# EAGLE design ciao_1_1 (EAGLE 8.5.2)
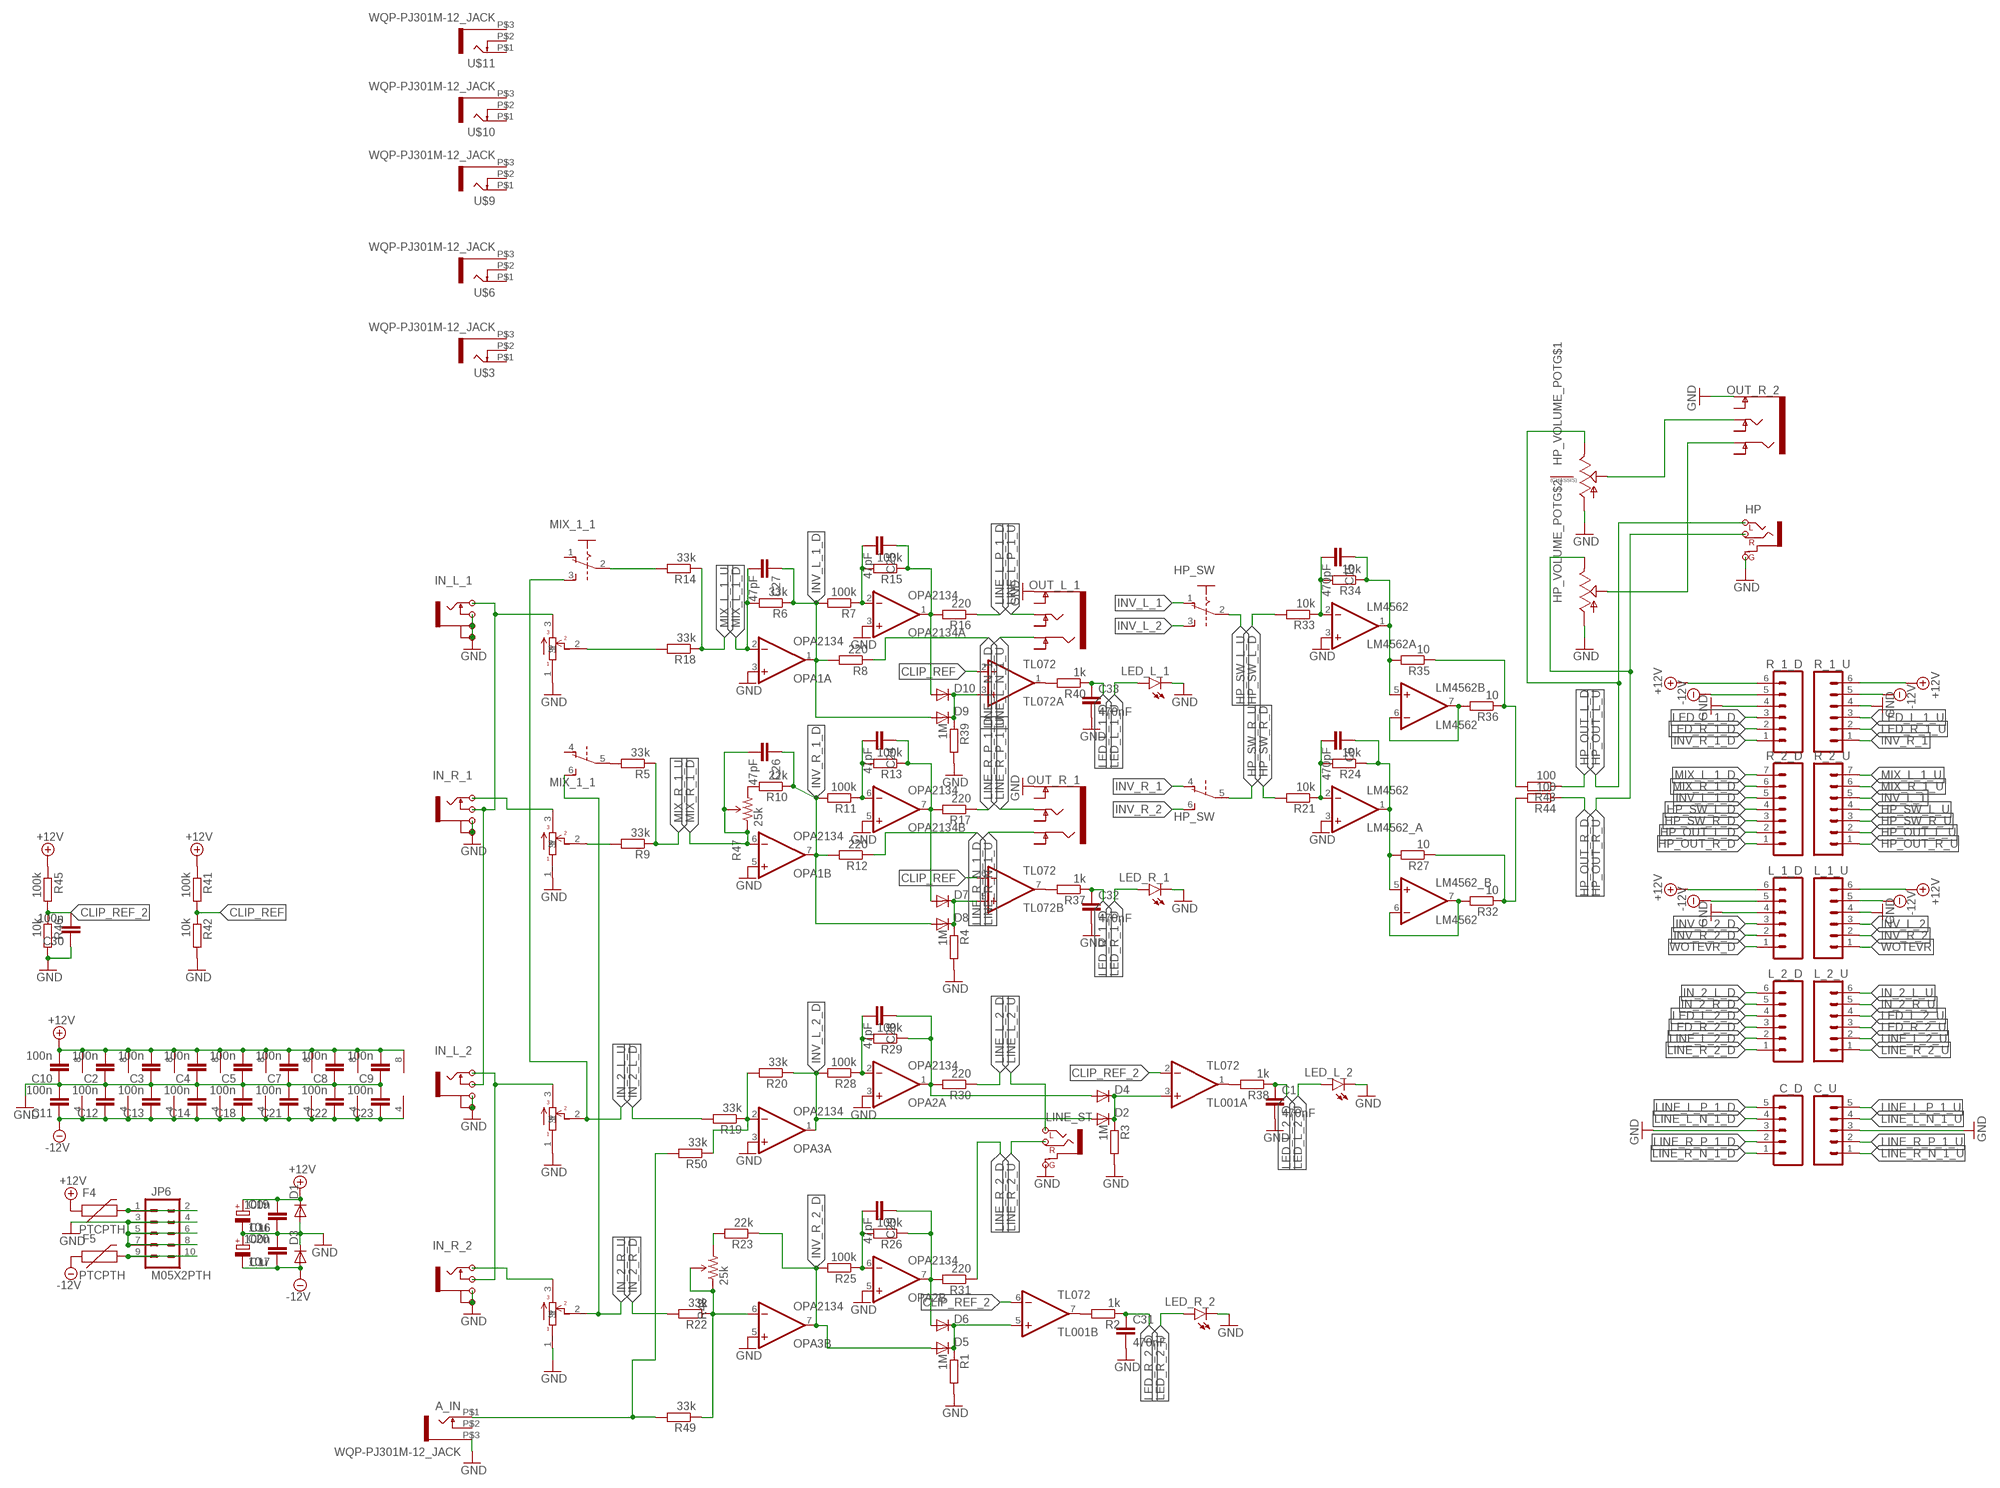
[diagram p0: schematic, sheet 1]

## Parts
A_IN  WQP-PJ301M-12_JACK  [WQP-PJ301M-12_JACK]
C1  470nF  C-EU050-024X044  [C050-024X044]
C2  100n  C-EU050-024X044  [C050-024X044]
C3  100n  C-EU050-024X044  [C050-024X044]
C4  100n  C-EU050-024X044  [C050-024X044]
C5  100n  C-EU050-024X044  [C050-024X044]
C6  470pF  C-EU050-024X044  [C050-024X044]
C7  100n  C-EU050-024X044  [C050-024X044]
C8  100n  C-EU050-024X044  [C050-024X044]
C9  100n  C-EU050-024X044  [C050-024X044]
C10  100n  C-EU050-024X044  [C050-024X044]
C11  100n  C-EU050-024X044  [C050-024X044]
C12  100n  C-EU050-024X044  [C050-024X044]
C13  100n  C-EU050-024X044  [C050-024X044]
C14  100n  C-EU050-024X044  [C050-024X044]
C15  470pF  C-EU050-024X044  [C050-024X044]
C16  100n  C-EU050-024X044  [C050-024X044]
C17  100n  C-EU050-024X044  [C050-024X044]
C18  100n  C-EU050-024X044  [C050-024X044]
C19  10u  CPOL-EUE2-5  [E2-5]
C20  10u  CPOL-EUE2-5  [E2-5]
C21  100n  C-EU050-024X044  [C050-024X044]
C22  100n  C-EU050-024X044  [C050-024X044]
C23  100n  C-EU050-024X044  [C050-024X044]
C24  47pF  C-EU050-024X044  [C050-024X044]
C25  47pF  C-EU050-024X044  [C050-024X044]
C26  47pF  C-EU050-024X044  [C050-024X044]
C27  47pF  C-EU050-024X044  [C050-024X044]
C28  47pF  C-EU050-024X044  [C050-024X044]
C29  47pF  C-EU050-024X044  [C050-024X044]
C30  100n  C-EU050-024X044  [C050-024X044]
C31  470nF  C-EU050-024X044  [C050-024X044]
C32  470nF  C-EU050-024X044  [C050-024X044]
C33  470nF  C-EU050-024X044  [C050-024X044]
C_D  M05PTH  [1X05]
C_U  M05PTH  [1X05]
CH_1_POT  POTAK_DUAL  [POTAK_DUAL]
CH_2_POT  POTAK_DUAL  [POTAK_DUAL]
D1  DIODE-D-7.5  [D-7.5]
D2  DIODE-D-5  [D-5]
D3  DIODE-D-7.5  [D-7.5]
D4  DIODE-D-5  [D-5]
D5  DIODE-D-5  [D-5]
D6  DIODE-D-5  [D-5]
D7  DIODE-D-5  [D-5]
D8  DIODE-D-5  [D-5]
D9  DIODE-D-5  [D-5]
D10  DIODE-D-5  [D-5]
F4  PTCPTH  [PTC]
F5  PTCPTH  [PTC]
HP  STEREO  [STEREO]
HP_SW  A68-A31  [A68-A31]
HP_VOLUME_POT  ALPHA-9MM-DUALPOT  [DUAL_9MM_SNAP-IN_POT]
IN_L_1  PJ-301BMB  [PJ-301BM-B]
IN_L_2  PJ-301BMB  [PJ-301BM-B]
IN_R_1  PJ-301BMB  [PJ-301BM-B]
IN_R_2  PJ-301BMB  [PJ-301BM-B]
JP6  M05X2PTH  [AVR_ICSP]
L_1_D  M06NO_SILK  [1X06_NO_SILK]
L_1_U  M06NO_SILK  [1X06_NO_SILK]
L_2_D  M06NO_SILK  [1X06_NO_SILK]
L_2_U  M06NO_SILK  [1X06_NO_SILK]
LED_L_1  LED3MM  [LED3MM]
LED_L_2  LED3MM  [LED3MM]
LED_R_1  LED3MM  [LED3MM]
LED_R_2  LED3MM  [LED3MM]
LINE_ST  STEREO  [STEREO]
LM4562  LM4562  TL072P  [DIL08]
LM4562_  LM4562  TL072P  [DIL08]
MIX_1_1  A68-A31  [A68-A31]
OPA1  OPA2134  TL072P  [DIL08]
OPA2  OPA2134  TL072P  [DIL08]
OPA3  OPA2134  TL072P  [DIL08]
OPA2134  OPA2134  TL072P  [DIL08]
OUT_L_1  AUDIO-JACK4-.25-HORIZ-TRS  [AUDIO-JACK-.25-INCH-HORIZ-PTH]
OUT_R_1  AUDIO-JACK4-.25-HORIZ-TRS  [AUDIO-JACK-.25-INCH-HORIZ-PTH]
OUT_R_2  AUDIO-JACK4-.25-HORIZ-TRS  [AUDIO-JACK-.25-INCH-HORIZ-PTH]
R1  1M  R-EU_0204/5  [0204/5]
R2  1k  R-EU_0204/5  [0204/5]
R3  1M  R-EU_0204/5  [0204/5]
R4  1M  R-EU_0204/5  [0204/5]
R5  33k  R-EU_0204/5  [0204/5]
R6  33k  R-EU_0204/5  [0204/5]
R7  100k  R-EU_0204/5  [0204/5]
R8  220  R-EU_0204/5  [0204/5]
R9  33k  R-EU_0204/5  [0204/5]
R10  22k  R-EU_0204/5  [0204/5]
R11  100k  R-EU_0204/5  [0204/5]
R12  220  R-EU_0204/5  [0204/5]
R13  100k  R-EU_0204/5  [0204/5]
R14  33k  R-EU_0204/5  [0204/5]
R15  100k  R-EU_0204/5  [0204/5]
R16  220  R-EU_0204/5  [0204/5]
R17  220  R-EU_0204/5  [0204/5]
R18  33k  R-EU_0204/5  [0204/5]
R19  33k  R-EU_0204/5  [0204/5]
R20  33k  R-EU_0204/5  [0204/5]
R21  10k  R-EU_0204/5  [0204/5]
R22  33k  R-EU_0204/5  [0204/5]
R23  22k  R-EU_0204/5  [0204/5]
R24  10k  R-EU_0204/5  [0204/5]
R25  100k  R-EU_0204/5  [0204/5]
R26  100k  R-EU_0204/5  [0204/5]
R27  10  R-EU_0204/5  [0204/5]
R28  100k  R-EU_0204/5  [0204/5]
R29  100k  R-EU_0204/5  [0204/5]
R30  220  R-EU_0204/5  [0204/5]
R31  220  R-EU_0204/5  [0204/5]
R32  10  R-EU_0204/5  [0204/5]
R33  10k  R-EU_0204/5  [0204/5]
R34  10k  R-EU_0204/5  [0204/5]
R35  10  R-EU_0204/5  [0204/5]
R36  10  R-EU_0204/5  [0204/5]
R37  1k  R-EU_0204/5  [0204/5]
R38  1k  R-EU_0204/5  [0204/5]
R39  1M  R-EU_0204/5  [0204/5]
R40  1k  R-EU_0204/5  [0204/5]
R41  100k  R-EU_0204/5  [0204/5]
R42  10k  R-EU_0204/5  [0204/5]
R43  100  R-EU_0204/5  [0204/5]
R44  100  R-EU_0204/5  [0204/5]
R45  100k  R-EU_0204/5  [0204/5]
R46  10k  R-EU_0204/5  [0204/5]
R47  25k  TRIMPOTTRIM_POT_PTH_STAND  [TRIM_POT_PTH_STAND]
R48  25k  TRIMPOTTRIM_POT_PTH_STAND  [TRIM_POT_PTH_STAND]
R49  33k  R-EU_0204/5  [0204/5]
R50  33k  R-EU_0204/5  [0204/5]
R_1_D  M06NO_SILK  [1X06_NO_SILK]
R_1_U  M06NO_SILK  [1X06_NO_SILK]
R_2_D  M07  [1X07]
R_2_U  M07  [1X07]
TL001  TL072  TL072P  [DIL08]
TL072  TL072  TL072P  [DIL08]
U$3  WQP-PJ301M-12_JACK  [WQP-PJ301M-12_JACK]
U$6  WQP-PJ301M-12_JACK  [WQP-PJ301M-12_JACK]
U$9  WQP-PJ301M-12_JACK  [WQP-PJ301M-12_JACK]
U$10  WQP-PJ301M-12_JACK  [WQP-PJ301M-12_JACK]
U$11  WQP-PJ301M-12_JACK  [WQP-PJ301M-12_JACK]

## Nets
+12V: C2.2 C3.2 C4.2 C5.2 C7.2 C8.2 C9.2 C10.2 C16.2 C19.+ D1.C F4.P$1 L_1_D.6 L_1_U.6 LM4562.8(P:V+) LM4562_.8(P:V+) OPA1.8(P:V+) OPA2.8(P:V+) OPA3.8(P:V+) OPA2134.8(P:V+) R41.1 R45.1 R_1_D.6 R_1_U.6 TL001.8(P:V+) TL072.8(P:V+)
-12V: C11.1 C12.1 C13.1 C14.1 C17.1 C18.1 C20.- C21.1 C22.1 C23.1 D3.A F5.P$1 L_1_D.5 L_1_U.5 LM4562.4(P:V-) LM4562_.4(P:V-) OPA1.4(P:V-) OPA2.4(P:V-) OPA3.4(P:V-) OPA2134.4(P:V-) R_1_D.5 R_1_U.5 TL001.4(P:V-) TL072.4(P:V-)
CLIP_REF: R41.2 R42.1 TL072.2(A:-IN) TL072.6(B:-IN)
CLIP_REF_2: C30.2 R45.2 R46.1 TL001.2(A:-IN) TL001.6(B:-IN)
CLIP_REF_ADFPOASH: D5.C D6.C R1.1 TL001.5(B:+IN)
GND: A_IN.P$3 C1.2 C2.1 C3.1 C4.1 C5.1 C7.1 C8.1 C9.1 C10.1 C11.2 C12.2 C13.2 C14.2 C16.1 C17.2 C18.2 C19.- C20.+ C21.2 C22.2 C23.2 C30.1 C31.2 C32.2 C33.2 C_D.3 C_U.3 CH_1_POT.1 CH_1_POT.1_ CH_2_POT.1 CH_2_POT.1_ D1.A D3.C HP.GND(G) HP_VOLUME_POT.1(A) HP_VOLUME_POT.1B(A) IN_L_1.G1 IN_L_1.G2 IN_L_1.SW IN_L_2.G1 IN_L_2.G2 IN_R_1.G1 IN_R_1.G2 IN_R_2.G1 IN_R_2.G2 JP6.3 JP6.4 JP6.5 JP6.6 JP6.7 JP6.8 L_1_D.4 L_1_U.4 LED_L_1.K(C) LED_L_2.K(C) LED_R_1.K(C) LED_R_2.K(C) LINE_ST.GND(G) LM4562.3(A:+IN) LM4562_.3(A:+IN) OPA1.3(A:+IN) OPA1.5(B:+IN) OPA2.3(A:+IN) OPA2.5(B:+IN) OPA3.3(A:+IN) OPA3.5(B:+IN) OPA2134.3(A:+IN) OPA2134.5(B:+IN) OUT_L_1.P$2(EARTH) OUT_R_1.P$2(EARTH) OUT_R_2.P$2(EARTH) R1.2 R3.2 R4.2 R39.2 R42.2 R46.2 R_1_D.4 R_1_U.4
HP_OUT_L_D: R43.1 R_2_D.2
HP_OUT_L_U: HP.LEFT_(L) HP_VOLUME_POT.3(E) R_2_U.2
HP_OUT_R_D: R44.1 R_2_D.1
HP_OUT_R_U: HP.RIGHT_(R) HP_VOLUME_POT.3B(E) R_2_U.1
HP_SW_L_D: R33.2 R_2_D.4
HP_SW_L_U: HP_SW.2(A:P) R_2_U.4
HP_SW_R_D: R21.2 R_2_D.3
HP_SW_R_U: HP_SW.5(B:P) R_2_U.3
IN_2_L_D: L_2_D.6 R19.2
IN_2_L_U: CH_2_POT.2 L_2_U.6 MIX_1_1.3(A:S)
IN_2_R_D: L_2_D.5 R22.2
IN_2_R_U: CH_2_POT.2_ L_2_U.5 MIX_1_1.6(B:S)
INV_L_1: HP_SW.1(A:O) R_2_U.5
INV_L_1_D: C27.1 D9.A OPA1.1(A:OUT) R6.1 R7.2 R8.2 R_2_D.5
INV_L_2: HP_SW.3(A:S) L_1_U.3
INV_L_2_D: D2.A L_1_D.3 OPA3.1(A:OUT) R20.1 R28.2
INV_R_1: HP_SW.4(B:O) R_1_U.1
INV_R_1_D: C26.1 D8.A OPA1.7(B:OUT) R10.1 R11.2 R12.2 R_1_D.1
INV_R_2: HP_SW.6(B:S) L_1_U.2
INV_R_2_D: D5.A L_1_D.2 OPA3.7(B:OUT) R23.1 R25.2
LED_L_1_D: C33.1 R40.1 R_1_D.3
LED_L_1_U: LED_L_1.A R_1_U.3
LED_L_2_D: C1.1 L_2_D.4 R38.1
LED_L_2_U: L_2_U.4 LED_L_2.A
LED_R_1_D: C32.1 R37.1 R_1_D.2
LED_R_1_U: LED_R_1.A R_1_U.2
LED_R_2_D: C31.1 L_2_D.3 R2.1
LED_R_2_U: L_2_U.3 LED_R_2.A
LINE_L_2_D: L_2_D.2 R30.1
LINE_L_2_U: L_2_U.2 LINE_ST.LEFT_(L)
LINE_L_N_1_D: C_D.4 R8.1
LINE_L_N_1_U: C_U.4 OUT_L_1.P$4(RING)
LINE_L_P_1_D: C_D.5 R16.1
LINE_L_P_1_U: C_U.5 OUT_L_1.P$6(TIP)
LINE_R_2_D: L_2_D.1 R31.1
LINE_R_2_U: L_2_U.1 LINE_ST.RIGHT_(R)
LINE_R_N_1_D: C_D.1 R12.1
LINE_R_N_1_U: C_U.1 OUT_R_1.P$4(RING)
LINE_R_P_1_D: C_D.2 R17.1
LINE_R_P_1_U: C_U.2 OUT_R_1.P$6(TIP)
MIX_L_1_D: C27.2 OPA1.2(A:-IN) R6.2 R_2_D.7
MIX_L_1_U: R14.1 R18.1 R_2_U.7
MIX_R_1_D: C26.2 OPA1.6(B:-IN) R47.1(CCW) R47.2(WIPER) R_2_D.6
MIX_R_1_U: R5.1 R9.1 R_2_U.6
N$1: R10.2 R47.3(CW)
N$2: CH_2_POT.3 IN_L_2.T IN_R_2.SW
N$3: R40.2 TL072.1(A:OUT)
N$4: CH_2_POT.3_ IN_R_2.T
N$5: C25.2 OPA2134.2(A:-IN) R7.1 R15.2
N$6: OPA3.6(B:-IN) R22.1 R48.1(CCW) R48.2(WIPER) R49.1
N$7: CH_1_POT.3_ IN_R_1.T
N$8: R23.2 R48.3(CW)
N$9: HP_VOLUME_POT.2(S)
N$10: C25.1 D10.A OPA2134.1(A:OUT) R15.1 R16.2
N$11: C24.2 OPA2134.6(B:-IN) R11.1 R13.2
N$12: A_IN.P$1 R49.2 R50.2
N$13: HP_VOLUME_POT.2B(S)
N$14: C24.1 D7.A OPA2134.7(B:OUT) R13.1 R17.2
N$15: CH_1_POT.2_ R9.2
N$16: CH_1_POT.2 R18.2
N$17: OPA3.2(A:-IN) R19.1 R20.2 R50.1
N$21: MIX_1_1.5(B:P) R5.2
N$22: MIX_1_1.2(A:P) R14.2
N$24: C29.2 OPA2.6(B:-IN) R25.1 R26.2
N$25: C29.1 D6.A OPA2.7(B:OUT) R26.1 R31.2
N$26: C6.2 LM4562_.2(A:-IN) R21.1 R24.2
N$27: C28.2 OPA2.2(A:-IN) R28.1 R29.2
N$28: C28.1 D4.A OPA2.1(A:OUT) R29.1 R30.2
N$30: C6.1 LM4562_.1(A:OUT) LM4562_.5(B:+IN) R24.1 R27.2
N$31: LM4562_.6(B:-IN) LM4562_.7(B:OUT) R32.2
N$32: R27.1 R32.1 R44.2
N$33: C15.2 LM4562.2(A:-IN) R33.1 R34.2
N$34: C15.1 LM4562.1(A:OUT) LM4562.5(B:+IN) R34.1 R35.2
N$35: LM4562.6(B:-IN) LM4562.7(B:OUT) R36.2
N$36: R37.2 TL072.7(B:OUT)
N$37: R35.1 R36.1 R43.2
N$42: D2.C D4.C R3.1 TL001.3(A:+IN)
N$43: CH_1_POT.3 IN_L_1.T IN_L_2.SW IN_R_1.SW
N$44: F4.P$2 JP6.1 JP6.2
N$45: F5.P$2 JP6.9 JP6.10
N$46: R38.2 TL001.1(A:OUT)
N$47: D7.C D8.C R4.1 TL072.5(B:+IN)
N$48: R2.2 TL001.7(B:OUT)
N$52: D9.C D10.C R39.1 TL072.3(A:+IN)
WOTEVR: L_1_U.1
WOTEVR_D: L_1_D.1
Unconnected: A_IN.P$2 HP_VOLUME_POT.CHASSIS1 HP_VOLUME_POT.CHASSIS2 MIX_1_1.1(A:O) MIX_1_1.4(B:O) OUT_L_1.P$3(EARTH-NORM) OUT_L_1.P$5(RING-NORM) OUT_L_1.P$7(TIP-NORM) OUT_R_1.P$3(EARTH-NORM) OUT_R_1.P$5(RING-NORM) OUT_R_1.P$7(TIP-NORM) OUT_R_2.P$3(EARTH-NORM) OUT_R_2.P$4(RING) OUT_R_2.P$5(RING-NORM) OUT_R_2.P$6(TIP) OUT_R_2.P$7(TIP-NORM) U$3.P$1 U$3.P$2 U$3.P$3 U$6.P$1 U$6.P$2 U$6.P$3 U$9.P$1 U$9.P$2 U$9.P$3 U$10.P$1 U$10.P$2 U$10.P$3 U$11.P$1 U$11.P$2 U$11.P$3

## Library data of the parts
A_IN U$3 U$6 U$9-U$11 = thonkiconn:WQP-PJ301M-12_JACK
C1-C18 C21-C33 = rcl:C-EU: CAPACITOR, European symbol
C19 C20 = rcl:CPOL-EU: POLARIZED CAPACITOR, European symbol
C_D C_U = SparkFun-Connectors:M05: Header 5 Standard 5-pin 0.1" header. Use with straight break away headers (SKU : PRT-00116), right angle break away headers (PRT-00553), swiss pins (PRT-00743), machine pins (PRT-00117), and female headers (PRT-00115). Molex polarized connector foot print use with SKU : PRT-08230 with associated crimp pins and housings.
CH_1_POT CH_2_POT = potak:POTAK_DUAL
D1-D10 = diode:DIODE-: DIODE
F4 F5 = SparkFun-PowerIC:PTC: Resettable Fuse PTC Resettable Fuse. Spark Fun Electronics SKU : COM-08357
HP LINE_ST = PJ-301BM:STEREO
HP_SW MIX_1_1 = switch:A68-A31: SLIDING SWITCH Siemens, distributor Buerklin, 11G766
HP_VOLUME_POT = MusicThingModular:ALPHA-9MM-DUALPOT: 9mm vertical snap-in pot, Alpha / Panasonic style, with a connection to the metal chassis for grounding
IN_L_1 IN_L_2 IN_R_1 IN_R_2 = PJ-301BM:PJ-301BM: PJ-301BM mfd. by Chuangjiebao 3.5mm Phone jack Mono, NC-switched. Vertical PCB mount, M6x0.5 threaded bushing. Jacks from 8/2009 Muffwiggler group buy.
JP6 = SparkFun-Connectors:M05X2: Header 5x2 Standard 10-pin dual row 0.1" header. Commonly used with AVR-ISP. Use with Spark Fun Electronics SKU: PRT-00778
L_1_D L_1_U L_2_D L_2_U R_1_D R_1_U = SparkFun-Connectors:M06: Header 6 Standard 6-pin 0.1" header. Use with straight break away headers (SKU : PRT-00116), right angle break away headers (PRT-00553), swiss pins (PRT-00743), machine pins (PRT-00117), and female headers (PRT-00115). Molex polarized connector foot print use with SKU : PRT-08094 with associated crimp pins and housings. NOTES ON THE VARIANTS LOCK and LOCK_LONGPADS... This footprint was designed to help hold the alignment of a through-hole component (i.e. 6-pin header) while soldering it into place. You may notice that each hole has been shifted either up or down by 0.005 of an inch from it's more standard position (which is a perfectly straight line). This slight alteration caused the pins (the squares in the middle) to touch the edges of the holes. Because they are alternating, it causes a "brace" to hold the component in place. 0.005 has proven to be the perfect amount of "off-center" position when using our standard breakaway headers. Although looks a little odd when you look at the bare footprint, once you have a header in there, the alteration is very hard to notice. Also,if you push a header all the way into place, it is covered up entirely on the bottom side. This idea of altering the position of holes to aid alignment will be further integrated into the Sparkfun Library for other footprints. It can help hold any component with 3 or more connection pins.
LED_L_1 LED_L_2 LED_R_1 LED_R_2 = SparkFun-LED:LED: LEDs Standard schematic elements and footprints for 5mm, 3mm, 1206, and 0603 sized LEDs. 5mm - Spark Fun Electronics SKU : COM-00529 (and others)
LM4562 LM4562_ OPA1-OPA3 OPA2134 TL001 TL072 = linear:TL072: OP AMP
OUT_L_1 OUT_R_1 OUT_R_2 = SparkFun-Connectors:AUDIO-JACK4-.25-HORIZ-TRS: 1/4" TRS jack, horizontal Production SKU: COM-11144 Footprint unproven - datasheet and part seem to be slightly different; PROD_ID: COM-11144
R1-R46 R49 R50 = rcl:R-EU_: RESISTOR, European symbol
R47 R48 = SparkFun-Electromechanical:TRIMPOT: Various small potentiometers for "set-and-forget" applications
R_2_D R_2_U = SparkFun-Connectors:M07: Header 7 Standard 7-pin 0.1" header. Use with straight break away headers (SKU : PRT-00116), right angle break away headers (PRT-00553), swiss pins (PRT-00743), machine pins (PRT-00117), and female headers (PRT-00115). NOTES ON THE VARIANTS LOCK and LOCK_LONGPADS... This footprint was designed to help hold the alignment of a through-hole component (i.e. 7-pin header) while soldering it into place. You may notice that each hole has been shifted either up or down by 0.005 of an inch from it's more standard position (which is usually a perfectly straight line). This slight alteration caused the pins (the squares in the middle) to touch the edges of the holes. Because they are alternating, it causes a "brace" to hold the header in place. 0.005 has proven to be the perfect amount of "off-center" position when using our standard breakaway headers. Although looks a little odd when you look at the bare footprint, once you have a header in there, the alteration is very hard to notice. Also, if you push a header all the way into place, it is covered up entirely on the bottom side. This idea of altering the position of holes to aid alignment will be further integrated into the Sparkfun Library for other footprints. It can help hold any component with 3 or more connection pins.

## Board
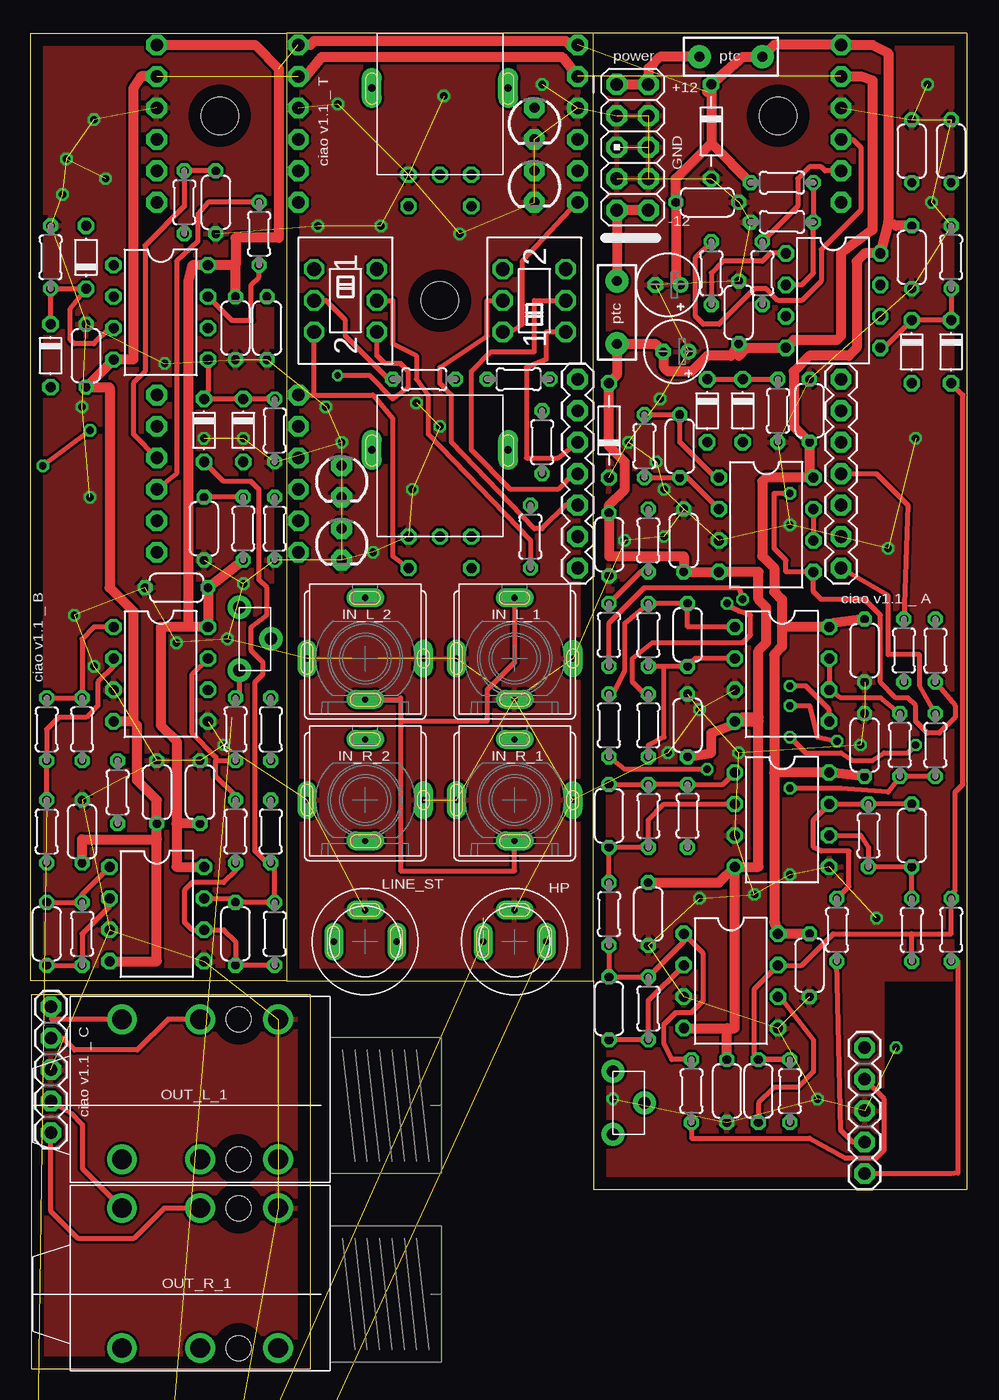
[diagram p1: board, top side]
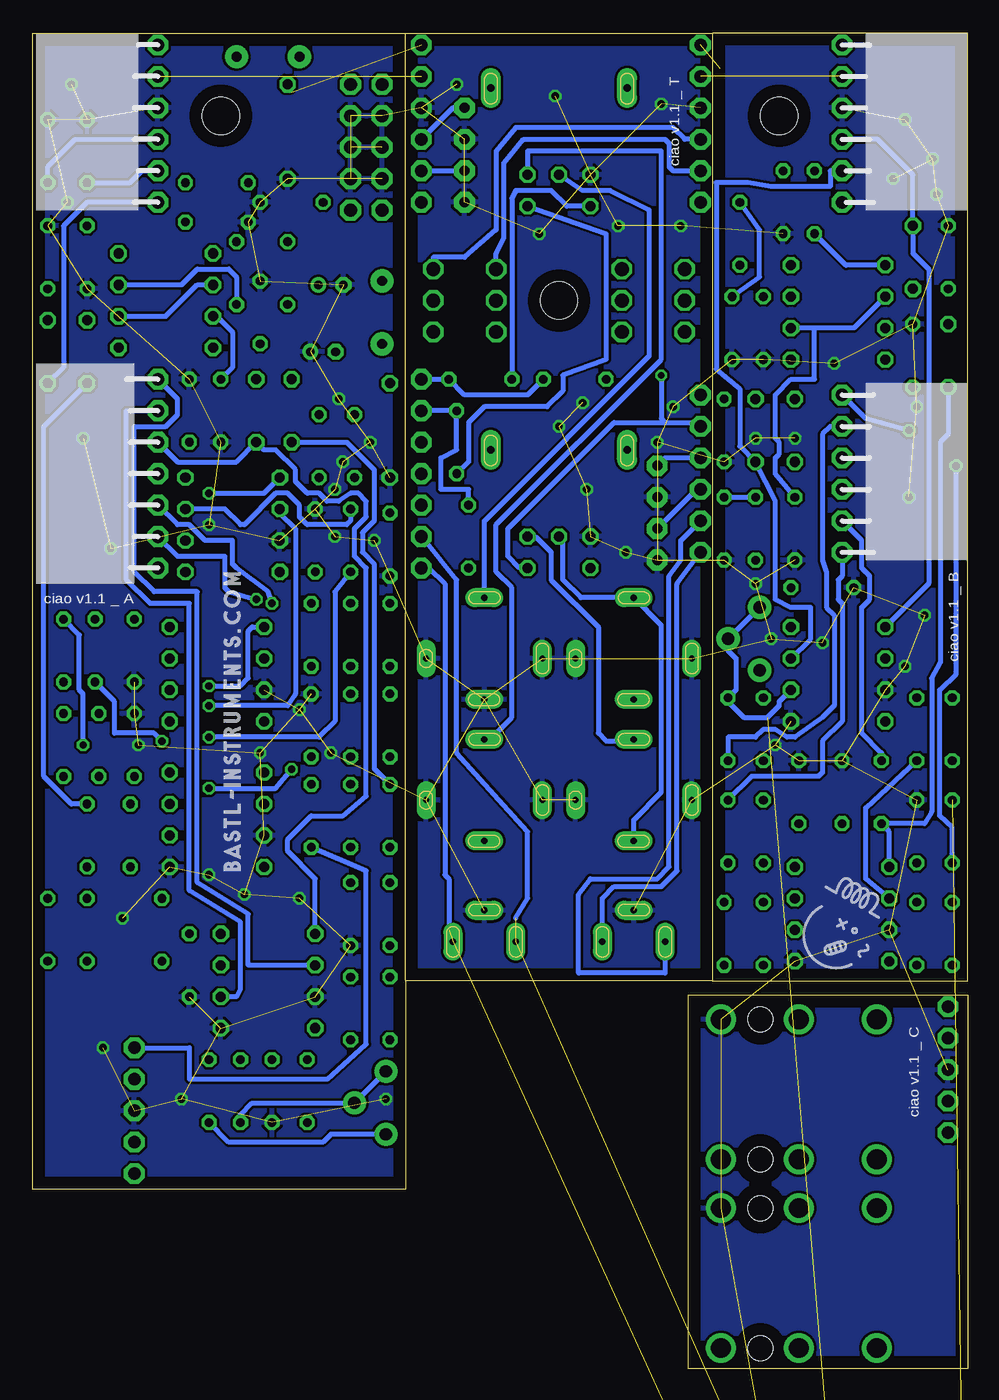
[diagram p2: board, bottom side, seen from below]

Size 75.56 x 107.81 mm. Coordinates in mm from the lower left corner, seen from the top.
Outline: 20.64,31.29 45.4,31.29
Outline: 45.4,31.29 45.4,107.81
Outline: 45.4,107.81 20.64,107.81
Outline: 20.64,107.81 20.64,31.29
Outline: 20.64,107.81 0,107.81 0,31.29 20.64,31.29
Outline: 45.4,31.29 45.4,14.46 75.57,14.46 75.57,107.81 45.4,107.81
Outline: 0.02,0 22.56,0 22.56,30.16 0.02,30.16 0.02,0
Copper layers (1*16): Top 0.035mm / dielectric 1.5mm / Bottom 0.035mm
Design rules "default": minimum track width 10mil, minimum drill 24mil, track to track 8mil, track to pad 8mil, pad to pad 8mil, via to via 8mil, smd to smd 8mil, copper to edge 40mil, drill to drill 8mil, minimum pad ring 10mil, minimum via ring 8mil, stop-mask expansion 4mil, vias tented up to drill 0mil, thermal gap 10mil

### Footprints (pad centres in the part's own frame; a part is rotated, then mirrored left to right if it is on the bottom)
WQP-PJ301M-12_JACK = drill 1.1: P$1 0,5; P$2 0,-3.5; P$3 0,-6.5
C050-024X044 = drill 0.7 octagon: 1 -2.54,0; 2 2.54,0
E2-5 = drill 0.7 pad 1.27: + -1.016,0 | drill 0.7 pad 1.27 octagon: - 1.016,0
1X05 = drill 1.016 pad 1.676 octagon: 1 0,0; 2 2.54,0; 3 5.08,0; 4 7.62,0; 5 10.16,0
POTAK_DUAL = drill 0.8 octagon: 1 -2.54,0; 1_ -2.54,0; 2 -2.54,-2.54; 2_ 2.54,-2.54; 3 0,0; 3_ 2.54,0 | drill 0.6 pad 1.6 long: P$1 -5.5,7; P$2 5.5,7
D-7.5 = drill 0.813 octagon: A 3.81,0; C -3.81,0
D-5 = drill 0.813 octagon: A 2.54,0; C -2.54,0
PTC = drill 0.8 pad 1.88: P$1 -2.54,0; P$2 2.54,0
STEREO = drill 0.5 pad 1.524 long: GND 0,0.002; LEFT_ 2.538,2.54; RIGHT_ -2.542,2.54
A68-A31 = drill 1.1 octagon: 1 -2.54,-2.54; 2 0,-2.54; 3 2.54,-2.54; 4 -2.54,2.54; 5 0,2.54; 6 2.54,2.54
DUAL_9MM_SNAP-IN_POT = drill 1.1 square: 1 -2.5,-7; 1B -2.5,-9.54 | drill 1.1 octagon: 2 0,-7; 2B 0,-9.54; 3 2.5,-7; 3B 2.5,-9.54 | drill 2.1 pad 2.54: CHASSIS1 -4.5,0; CHASSIS2 4.5,0
PJ-301BM-B = drill 0.5 pad 1.524 long: G1 -4.7,0; G2 4.7,0; SW 0,-3.3; T 0,4.9
AVR_ICSP = drill 1.016 pad 1.676 octagon: 1 -1.27,5.08; 2 1.27,5.08; 3 -1.27,2.54; 4 1.27,2.54; 5 -1.27,0; 6 1.27,0; 7 -1.27,-2.54; 8 1.27,-2.54; 9 -1.27,-5.08; 10 1.27,-5.08
1X06_NO_SILK = drill 1.016 pad 1.676 octagon: 1 0,0; 2 2.54,0; 3 5.08,0; 4 7.62,0; 5 10.16,0; 6 12.7,0
LED3MM = drill 0.813 pad 1.676 octagon: A -1.27,0; K 1.27,0
DIL08 = drill 0.813 pad 1.27 octagon: 1 -3.81,-3.81; 2 -1.27,-3.81; 3 1.27,-3.81; 4 3.81,-3.81; 5 3.81,3.81; 6 1.27,3.81; 7 -1.27,3.81; 8 -3.81,3.81
AUDIO-JACK-.25-INCH-HORIZ-PTH = drill 1.6: P$2 4.2,-6.92; P$3 4.2,4.38; P$4 10.5,-6.92; P$5 10.5,4.38; P$6 16.8,-6.92; P$7 16.8,4.38 | hole 2: 7.4,4.38; 7.4,-6.92
0204/5 = drill 0.7 octagon: 1 -2.54,0; 2 2.54,0
TRIM_POT_PTH_STAND = drill 1 pad 1.88: 1 -2.54,0; 2 0,2.54; 3 2.54,0
1X07 = drill 1.016 pad 1.676 octagon: 1 0,0; 2 2.54,0; 3 5.08,0; 4 7.62,0; 5 10.16,0; 6 12.7,0; 7 15.24,0
3,0 = hole 3: 0,0

### Placement (x,y rotation side)
A_IN  -17.46,-188.1 0 top  (outside the outline)
C1  14.92,94.16 270 top
C2  62.86,77.33 270 top
C3  16.51,84 90 top
C4  11.75,63.04 0 top
C5  71.12,89.71 90 top
C6  53.02,59.23 270 top
C7  67.31,50.34 270 top
C8  62.86,32.56 90 top
C9  67.31,57.96 90 top
C10  54.61,94.16 180 top
C11  56.2,22.4 270 top
C12  49.85,36.69 270 top
C13  53.02,51.93 90 top
C14  57.15,85.27 90 top
C15  52.39,74.47 270 top
C16  13.65,46.53 270 top
C17  46.67,66.53 270 top
C18  52.7,66.85 90 top
C19  51.44,87.49 180 top
C20  52.07,82.09 180 top
C21  10.16,46.53 90 top
C22  4.13,43.36 90 top
C23  4.45,81.77 90 top
C24  71.12,43.04 270 top
C25  46.67,44.62 270 top
C26  58.74,22.4 270 top
C27  46.67,29.07 270 top
C28  1.27,35.1 270 top
C29  16.51,35.1 270 top
C30  13.97,67.8 90 top
C31  19.05,84 270 top
C32  71.12,98.28 90 top
C33  74.3,98.28 90 top
C_D  67.31,15.73 90 top
C_U  1.61,19.05 90 top
CH_1_POT  33.02,96.38 0 top
CH_2_POT  33.02,67.17 0 top
D1  54.93,99.87 270 top
D2  4.45,89.71 90 top
D3  46.67,75.74 90 top
D4  1.59,81.77 270 top
D5  17.14,75.74 270 top
D6  13.97,75.74 270 top
D7  71.12,82.09 270 top
D8  74.3,82.09 270 top
D9  57.47,77.33 270 top
D10  54.61,77.33 270 top
F4  56.52,105.9 180 top
F5  47.31,85.27 90 top
HP  39.05,37.01 180 top
HP_SW  40.64,86.22 90 top
HP_VOLUME_POT  -93.66,-246.52 0 top  (outside the outline)
IN_L_1  39.05,57.33 0 top
IN_L_2  26.99,57.33 0 top
IN_R_1  39.05,45.9 0 top
IN_R_2  26.99,45.9 0 top
JP6  48.58,98.6 0 top
L_1_D  10.16,94.16 90 top
L_1_U  21.59,94.16 90 top
L_2_D  10.16,65.9 90 top
L_2_U  21.59,65.9 90 top
LED_L_1  40.64,100.5 270 top
LED_L_2  25.08,71.61 270 top
LED_R_1  40.64,95.42 270 top
LED_R_2  25.08,66.53 270 top
LINE_ST  26.99,37.01 180 top
LM4562  59.37,68.12 270 top
LM4562_  60.64,56.05 270 top
MIX_1_1  25.4,86.22 270 top
OPA1  56.52,31.29 270 top
OPA2  10.16,36.69 270 top
OPA3  10.48,56.05 270 top
OPA2134  60.64,44.31 270 top
OUT_L_1  24.15,21.27 180 top
OUT_R_1  24.15,6.03 180 top
OUT_R_2  -103.82,-282.08 0 top  (outside the outline)
R1  19.68,75.74 270 top
R2  18.41,91.61 270 top
R3  1.59,89.71 90 top
R4  74.3,89.71 90 top
R5  40.32,67.17 270 top
R6  49.85,29.07 270 top
R7  46.67,36.69 270 top
R8  53.34,22.4 90 top
R9  41.27,74.79 270 top
R10  61.28,22.4 270 top
R11  71.12,35.42 270 top
R12  74.3,35.42 90 top
R13  67.63,43.04 270 top
R14  31.75,79.87 180 top
R15  49.85,44.62 270 top
R16  53.02,44.62 90 top
R17  65.09,35.42 90 top
R18  39.37,79.87 180 top
R19  1.27,43.36 270 top
R20  1.27,51.61 270 top
R21  49.85,51.93 90 top
R22  19.37,51.61 270 top
R23  16.51,51.61 90 top
R24  49.85,59.23 270 top
R25  16.51,43.36 90 top
R26  19.68,35.1 270 top
R27  46.67,51.93 90 top
R28  4.13,51.61 90 top
R29  4.13,35.1 270 top
R30  6.98,46.53 270 top
R31  19.37,43.36 270 top
R32  70.17,50.34 90 top
R33  70.48,57.96 90 top
R34  49.53,74.47 270 top
R35  73.03,57.96 270 top
R36  49.85,66.85 90 top
R37  59.05,88.44 270 top
R38  12.38,94.16 270 top
R39  60.33,77.33 270 top
R40  54.93,88.44 270 top
R41  60.64,95.74 0 top
R42  60.64,92.57 180 top
R43  46.67,59.23 90 top
R44  73.03,50.34 270 top
R45  17.14,67.8 90 top
R46  19.68,67.8 270 top
R47  46.99,21.45 270 top
R48  16.83,58.91 270 top
R49  0.32,-167.78 0 top  (outside the outline)
R50  0.32,-198.26 0 top  (outside the outline)
R_1_D  65.41,94.16 90 top
R_1_U  44.13,94.16 90 top
R_2_D  65.41,64.63 90 top
R_2_U  44.13,64.63 90 top
TL001  10.48,85.27 270 top
TL072  64.77,86.22 270 top
U$2  [3,0]  33.02,86.22 0 top
U$3  -35.24,-188.1 0 top  (outside the outline)
U$4  [BASTL_WEB_2]  58.74,40.18 90 bottom
U$5  [BASTL_HLAVA_1]  13.33,32.24 0 bottom
U$6  -53.02,-188.1 0 top  (outside the outline)
U$7  [3,0]  60.33,101.14 0 top
U$8  [3,0]  15.24,101.14 0 top
U$9  -70.8,-188.1 0 top  (outside the outline)
U$10  -88.58,-188.1 0 top  (outside the outline)
U$11  -106.36,-188.1 0 top  (outside the outline)

### Tracks (layer width: path | path; a pad name or v marks a point on that pad's centre or on a via)
+12V  (2 unrouted)
  Top 0.813: D1.C 54.61,103.05 | D1.C 57.47,105.9 F4.P$1 60.01,106.86 R_1_D.6 67.94,106.86 69.22,106.22 69.22,92.57 | 69.22,92.57 TL072.8 67.31,90.03 66.68,89.39 66.68,82.41 66.04,81.77 62.86,81.77 61.6,80.5 61.6,76.06 C2.2 62.86,72.25 LM4562.8 59.37,71.93 59.05,71.61 59.05,65.58 60.01,64.63 60.01,62.72 60.64,62.09 60.64,59.87 | C5.2 69.85,92.25 69.22,92.57 | 60.64,59.87 60.64,58.28 60.01,57.64 60.01,48.12 | 60.01,48.12 60.01,36.05 OPA1.8 C8.2 | 60.01,48.12 OPA2134.8 C7.2 | C9.2 64.77,60.18 LM4562_.8 60.64,59.87 | R_1_U.6 43.5,106.86 43.18,107.17 22.86,107.17 22.54,106.86 L_1_U.6 | L_1_D.6 18.1,106.86 20,104.95 20,91.3 16.51,91.3 16.51,89.08 | 16.51,89.08 TL001.8 13.02,89.08 12.7,87.81 12.7,59.87 | C3.2 16.51,89.08 | 12.7,59.87 10.48,59.87 10.48,51.93 11.75,50.66 11.75,43.99 | 11.75,43.99 11.75,40.5 OPA2.8 | C16.2 11.75,43.99 | 12.7,59.87 OPA3.8 C4.2 R45.1 | D1.C 54.93,98.92 | 54.93,98.92 R41.1 | C19.+ 52.07,87.87 C10.2 52.07,96.06 54.93,98.92
-12V  (2 unrouted)
  Top 0.813: C11.1 56.2,27.48 | OPA1.4 56.2,27.48 | 56.2,27.48 56.83,27.48 OPA2134.4 | OPA2134.4 58.74,40.5 58.74,52.25 | 58.74,52.25 58.74,52.56 | 58.74,52.56 58.74,57.96 59.37,58.59 59.37,61.45 58.74,62.09 58.74,64.31 LM4562.4 C18.1 52.71,65.58 46.67,65.58 C17.1 46.67,69.71 47.94,70.98 47.94,73.2 46.67,74.47 D3.A 47.31,80.19 F5.P$1 50.42,82.73 C20.- 51.12,82.03 51.12,80.82 51.43,80.5 53.34,80.5 54.61,81.77 56.51,81.77 C14.1 57.15,81.77 57.79,82.41 TL072.4 61.6,83.04 65.09,83.04 65.4,83.36 65.4,90.03 67.94,91.93 67.94,104 66.99,104.31 R_1_D.5 | C13.1 54.93,49.7 54.93,51.29 56.51,51.93 LM4562_.4 | 58.74,52.56 57.47,52.56 56.83,51.93 LM4562_.4 | LM4562_.4 58.74,52.25 | C12.1 55.56,39.23 OPA2134.4 | L_1_U.5 22.22,104.31 23.49,105.9 42.86,105.9 R_1_U.5 | L_1_D.5 8.89,104.31 8.25,103.36 8.25,81.45 TL001.4 C23.1 6.35,79.23 6.35,63.04 8.25,61.14 8.25,52.25 | 8.25,52.25 OPA3.4 | OPA2.4 10.16,32.88 10.16,42.72 | 10.16,42.72 C21.1 10.16,45.9 8.57,47.48 8.57,51.93 8.25,52.25 | C22.1 4.13,42.72 10.16,42.72
CLIP_REF
  Top 0.406: TL072.2 62.23,87.49 63.18,88.44 R42.1 R41.2
  Bottom 0.406: TL072.6 64.77,84.95 62.23,87.49 TL072.2
CLIP_REF_2
  Top 0.406: R45.2 C30.2
  Bottom 0.406: TL001.2 9.21,84 12.38,84 | 12.38,84 TL001.6 | R46.1 R45.2 | C30.2 15.56,72.25 15.56,73.52 15.24,73.84 15.24,74.79 15.56,75.11 15.56,78.6 14.29,79.87 12.38,79.87 12.38,84
CLIP_REF_ADFPOASH
  Top 0.406: R1.1 D5.C D6.C 14.29,78.92 TL001.5
GND  (via drill 0.6)  (126 unrouted)
  other vias: 71.44,75.11 72.39,103.68 50.8,78.28 69.22,66.22 66.99,50.34 63.5,21.77 46.99,21.77 58.42,38.27 53.97,37.96 57.15,49.7 51.44,49.7 53.97,53.2 47.94,66.85 51.12,70.98 50.48,73.2 48.26,74.79 4.76,70.34 3.49,60.82 5.08,56.69 10.79,81.14 2.86,97.65 6.03,96.06 5.08,100.82 2.54,94.79 34.61,91.61 28.26,92.25 23.18,92.25 33.34,102.73 41.27,103.68 24.77,102.09 31.11,77.96 25.08,74.79 30.8,70.98 33.02,76.06 61.28,68.12 51.12,67.17 69.85,25.89 68.26,36.37 61.28,39.86 27.62,65.9 15.88,58.91 11.75,58.59 15.56,50.34 17.14,75.11 4.13,77.64 13.97,75.11 17.14,63.36 72.71,94.16 23.81,77.64
  pour Bottom: -7.97,-2.82 100.93,-2.82 100.33,115.11 -8.57,115.11
  pour Top: -7.75,-2.42 64.24,-1.92 68.74,-2.42 68.74,31.46 77.14,31.46 77.64,32.66 98.74,112.89 -6.35,112.89
HP_OUT_L_D  (via drill 0.6)
  Top 0.406: R43.1 46.67,60.18 49.53,63.04 57.15,63.04 v57.47,62.09
  Bottom 0.406: R_2_D.2 63.82,65.58 60.01,65.58 60.01,63.04 59.69,62.72 v57.47,62.09
HP_OUT_L_U  (2 unrouted)
  Bottom 0.406: 36.51,36.37 35.56,37.96 35.56,43.36 41.27,49.7 41.27,63.68 43.81,66.85 R_2_U.2
HP_OUT_R_D
  Top 0.406: R44.1 71.75,55.1 71.75,57.64 69.22,57.64 69.22,62.4 R_2_D.1
HP_OUT_R_U  (2 unrouted)
  Bottom 0.406: R_2_U.1 43.5,64.63 42.23,63.36 42.23,39.86 41.91,39.55 41.91,35.42
HP_SW_L_D
  Top 0.406: R_2_D.4 68.26,72.25 70.8,69.71 R33.2
HP_SW_L_U
  Top 0.406: R_2_U.4 43.81,72.25 42.54,70.98 38.74,70.98 35.56,74.15 35.56,80.5 37.15,82.09 40.64,82.09 40.64,86.22 HP_SW.2
HP_SW_R_D  (via drill 0.6)
  Top 0.406: R21.2 49.53,54.47 48.58,55.42 48.58,57.33 50.16,58.59 57.47,58.59 58.1,59.23 58.1,60.82 57.15,61.14 56.51,61.45 v56.2,61.77
  Bottom 0.406: v56.2,61.77 56.51,62.72 59.05,64.63 59.37,64.95 59.37,66.85 61.6,66.85 62.86,68.12 63.82,68.12 R_2_D.3
HP_SW_R_U
  Top 0.406: R_2_U.3 43.18,69.71 41.27,67.8 40.64,67.8 33.97,74.79 33.97,78.6 33.02,79.55 33.02,80.82 36.83,83.36 36.83,86.22 HP_SW.5
IN_2_L_D  (via drill 0.6)
  Top 0.406: v0.95,72.88 v4.76,75.74
  Bottom 0.406: R19.2 1.27,43.67 2.29,44.62 2.29,54.79 0.95,56.05 v0.95,72.88 | v4.76,75.74 8.25,76.69 L_2_D.6
IN_2_L_U
  Top 0.406: 22.86,78.6 MIX_1_1.3 | L_2_U.6 22.86,78.6 | 22.86,78.6 27.62,78.6 29.21,76.69 29.21,65.58 CH_2_POT.2
IN_2_R_D
  Bottom 0.406: L_2_D.5 11.11,76.06 11.75,75.42 11.75,65.26 11.43,64.31 11.43,61.45 10.8,60.82 10.8,53.51 11.75,52.56 13.97,50.97 14.61,50.97 15.56,51.61 16.51,51.61 17.14,50.97 19.37,50.97 R22.2
IN_2_R_U  (via drill 0.5)
  Top 0.406: v24.77,80.19 27.31,80.19 29.21,78.28 30.48,79.23 30.48,80.5 29.84,81.14 28.58,81.14 27.94,81.77 MIX_1_1.6
  Bottom 0.406: CH_2_POT.2_ 36.19,64.63 37.15,65.58 37.15,67.8 28.58,76.37 24.45,76.37 | 24.45,76.37 21.91,76.37 L_2_U.5 | v24.77,80.19 24.77,76.69 24.45,76.37
INV_L_1
  Top 0.406: HP_SW.1 41.59,83.68 41.59,81.45 40,80.82 40,73.52 42.54,73.52 R_2_U.5
INV_L_1_D
  Top 0.406: R7.2 C27.1 R6.1 52.71,34.47 OPA1.1 54.29,33.51 54.29,29.7 53.34,28.75 52.07,28.75 51.12,27.8 51.12,26.21 51.75,24.94 R8.2
  Bottom 0.406: OPA1.1 52.71,39.55 54.93,41.77 54.93,42.72 53.02,44.62 50.48,44.62 48.58,46.21 48.58,64.63 49.53,65.58 49.53,67.8 48.58,68.75 48.58,70.03 49.21,70.66 49.85,70.66 50.8,70.03 51.75,70.03 52.39,70.66 53.34,70.66 54.29,71.61 54.29,72.56 55.88,74.15 56.83,74.15 D9.A 59.05,73.2 63.82,73.2 R_2_D.5
INV_L_2
  Bottom 0.406: L_1_U.3 22.86,99.23 23.81,100.19 36.51,100.19 38.1,98.28 38.1,91.93 40.64,89.71 43.18,89.71 HP_SW.3
INV_L_2_D
  Top 0.406: R20.1 R28.2 4.13,58.91 5.08,59.87 OPA3.1
  Bottom 0.406: L_1_D.3 7.3,99.23 4.45,96.38 D2.A 4.45,90.03 3.18,88.76 3.18,63.36 OPA3.1
INV_R_1
  Top 0.406: HP_SW.4 38.74,83.68 39.69,84.31 39.69,89.39 R_1_U.1
INV_R_1_D
  Top 0.406: C26.1 R10.1 58.42,24.94 58.42,30.65 OPA1.7 62.23,32.56 64.77,35.1 71.12,35.1 | 71.12,35.1 74.29,35.1 R12.2 74.29,38.27 74.61,38.59 74.61,46.53 75.25,47.16 75.25,78.6 D8.A | R11.2 71.12,35.1
  Bottom 0.406: R_1_D.1 71.12,94.15 73.03,92.25 73.03,80.82 D8.A
INV_R_2
  Bottom 0.406: 38.1,88.44 HP_SW.6 38.1,90.03 37.47,91.3 37.47,97.33 35.88,99.23 24.45,99.23 24.13,98.92 24.13,97.01 23.81,96.7 L_1_U.2
INV_R_2_D
  Top 0.406: R25.2 16.51,46.21 14.92,47.8 14.92,49.07 | OPA3.7 13.02,56.05 13.02,51.29 14.92,49.39 14.92,49.07 | 14.92,49.07 R23.1
  Bottom 0.406: L_1_D.2 11.11,96.7 11.11,95.42 15.87,95.42 17.78,95.74 20.32,95.74 20.32,80.69 18.41,79.11 18.41,74.47 D5.A 15.56,70.03 15.56,62.09 14.29,61.45 12.7,61.45 12.7,58.91 OPA3.7
LED_L_1_D
  Top 0.406: R_1_D.3 66.36,99.23 66.99,98.6 66.99,93.52 63.82,90.34 63.82,87.81 62.23,86.22 60.33,86.22 59.37,87.17 58.42,87.17 55.56,84.31 54.29,84.31 53.66,84.95 53.66,89.71 R40.1
  Bottom 0.406: C33.1 74.29,97.01 72.07,99.23 R_1_D.3
LED_L_1_U
  Bottom 0.406: LED_L_1.A 41.59,101.78 R_1_U.3
LED_L_2_D
  Top 0.406: L_2_D.4 8.25,75.42 8.25,79.55 9.21,80.5 9.21,90.66 12.38,93.84 R38.1 C1.1
LED_L_2_U
  Bottom 0.406: L_2_U.4 24.45,73.52 LED_L_2.A
LED_R_1_D
  Top 0.406: R_1_D.2 64.14,96.7 63.82,97.01 62.86,97.01 61.91,96.06 61.91,93.84 R37.1
  Bottom 0.406: C32.1 67.63,95.74 66.68,96.7 R_1_D.2
LED_R_1_U
  Bottom 0.406: R_1_U.2 LED_R_1.A
LED_R_2_D
  Top 0.406: R2.1 14.29,94.15 13.46,93.2 13.46,90.98 11.75,89.39 11.75,72.25 L_2_D.3
  Bottom 0.406: C31.1 16.83,88.12 16.83,91.93 R2.1
LED_R_2_U
  Bottom 0.406: L_2_U.3 21.91,70.98 LED_R_2.A
LINE_L_2_D
  Bottom 0.406: R30.1 6.99,49.7 8.57,51.29 8.57,61.45 7.94,62.09 7.94,63.99 8.57,64.63 8.57,66.85 L_2_D.2
LINE_L_2_U
  Bottom 0.406: LINE_ST.LEFT_ 24.45,31.93 31.43,31.93 31.43,38.27 30.48,39.55 25.08,39.55 24.13,40.5 24.13,63.99 23.18,65.26 23.18,66.85 L_2_U.2
LINE_L_N_1_D
  Top 0.406: R8.1 53.34,18.59 62.86,18.59 65.72,17 68.26,17 68.9,17.64 68.9,21.76 C_D.4
LINE_L_N_1_U
  Top 0.406: OUT_L_1.P$4 11.07,28.19 8.59,25.72 3.52,25.72 2.56,26.67 C_U.4
LINE_L_P_1_D
  Bottom 0.406: C_D.5 62.86,25.89 62.86,23.35 51.75,23.35 48.58,26.21 48.58,40.18 R16.1
LINE_L_P_1_U
  Top 0.406: OUT_L_1.P$6 1.68,28.19 C_U.5
LINE_R_2_D
  Bottom 0.406: L_2_D.1 10.16,63.99 10.48,63.68 10.48,62.09 10.16,61.77 10.16,52.25 11.75,50.66 11.75,48.12 12.07,47.8 17.46,47.8 R31.1
LINE_R_2_U
  Bottom 0.406: LINE_ST.RIGHT_ 29.53,37.96 28.57,38.91 24.76,38.91 23.49,40.18 23.49,63.36 L_2_U.1
LINE_R_N_1_D
  Top 0.406: R12.1 74.84,32.88 74.84,15.79 74.29,15.73 C_D.1
LINE_R_N_1_U
  Top 0.406: OUT_R_1.P$4 10.75,12.95 8.28,10.48 3.83,10.48 1.61,12.7 C_U.1
LINE_R_P_1_D
  Top 0.406: C_D.2 66.36,18.27 65.4,19.22 R17.1
LINE_R_P_1_U
  Top 0.406: C_U.2 3.2,20.64 4.15,19.69 4.15,16.15 OUT_R_1.P$6
MIX_L_1_D
  Top 0.406: C27.2 R6.2 49.85,29.7 OPA1.2
  Bottom 0.406: OPA1.2 58.1,32.56 58.1,36.69 62.23,39.23 62.23,62.72 65.72,62.72 67.31,64.31 67.31,76.06 64.77,76.06 63.82,77.01 63.82,78.28 R_2_D.7
MIX_L_1_U
  Bottom 0.406: R_2_U.7 R18.1 40.64,78.6 35.56,78.6 R14.1
MIX_R_1_D
  Top 0.406: C26.2 58.74,21.45 60.01,22.72 61.91,22.72 63.18,23.99 63.18,26.53 60.96,29.38 OPA1.6
  Bottom 0.406: R_2_D.6 67.94,77.33 67.94,63.68 66.04,61.77 62.86,61.77 62.86,38.59 58.74,36.05 58.74,30.65 59.05,30.02 OPA1.6 | R47.1 R47.2 57.79,21.45 58.74,20.49 C26.2
MIX_R_1_U
  Bottom 0.406: R_2_U.6 R9.1 41.27,74.15 42.54,73.52 42.54,70.98 40.32,70.98 R5.1
N$1
  Bottom 0.406: R47.3 51.43,18.91 52.07,18.27 59.69,18.27 R10.2
N$2
  Bottom 0.406: CH_2_POT.3 32.7,66.85 32.7,63.68 31.25,62.22 IN_L_2.T 24.77,60 24.77,46.53 26.99,44.31 IN_R_2.SW
N$3
  Top 0.406: TL072.1 59.69,90.03 59.05,89.39 55.88,89.39 54.93,88.44 R40.2
N$4
  Bottom 0.406: CH_2_POT.3_ 34.92,67.17 33.66,65.9 33.66,63.68 29.84,59.87 29.84,51.29 29.21,50.66 27.12,50.66 IN_R_2.T
N$5
  Top 0.406: R7.1 C25.2 R15.2 49.85,44.31 51.12,45.58 OPA2134.2
N$6  (1 unrouted)
  Bottom 0.406: OPA3.6 15.24,53.83 15.24,53.51 16.19,52.56 18.1,52.56 19.37,53.83 R22.1 18.73,54.79 18.73,57.33 19.37,57.96 R48.2 R48.1
N$7
  Bottom 0.406: IN_R_1.T 38.6,50.8 36.83,52.56 36.83,63.04 38.1,64.31 38.1,68.12 24.77,81.45 24.77,98.28 35.56,98.28 CH_1_POT.3_
N$8
  Top 0.406: R48.3 16.83,54.47 R23.2
N$10
  Top 0.406: C25.1 R15.1 R16.2 55.88,47.16 OPA2134.1
  Bottom 0.406: D10.A 50.16,74.79 47.94,72.56 47.94,68.44 48.9,67.48 48.9,65.9 47.94,64.95 47.94,48.44 C25.1
N$11
  Top 0.406: R11.1 C24.2 R13.2 67.63,42.08 66.99,43.04 OPA2134.6
N$12  (2 unrouted)
N$14
  Top 0.406: C24.1 R13.1 OPA2134.7 63.18,44.31 63.18,42.08 63.82,41.77 66.04,41.77 66.04,38.91 R17.2
  Bottom 0.406: C24.1 72.39,45.58 74.61,47.8 74.61,76.06 D7.A
N$15
  Bottom 0.406: CH_1_POT.2_ 29.21,91.61 29.21,81.45 32.7,80.19 32.7,78.92 33.97,77.64 39.05,77.64 40.32,76.37 40.32,73.2 R9.2
N$16
  Bottom 0.406: CH_1_POT.2 32.39,93.84 33.66,95.11 36.51,95.11 36.83,94.47 R18.2
N$17  (1 unrouted)
  Top 0.406: R19.1 R20.2 1.27,51.61 2.22,52.56 4.45,52.56 5.4,53.51 5.4,55.42 6.67,56.69 OPA3.2
N$21
  Top 0.406: MIX_1_1.5 29.21,86.22 29.21,82.73 31.11,81.77 31.11,79.87 32.07,78.6 32.07,75.42 40.32,66.85 R5.2
N$22
  Top 0.406: R14.2 28.89,79.87 25.4,83.36 25.4,84.63 23.81,86.22 MIX_1_1.2
N$24
  Top 0.406: R26.2 C29.2 16.51,34.47 15.56,35.42 OPA2.6 13.02,35.42 12.38,36.05 12.38,38.59 13.02,39.23 15.56,39.23 16.51,40.18 R25.1
N$25
  Top 0.406: OPA2.7 16.19,37.96 C29.1 R26.1 19.68,40.5 R31.2 19.05,40.82 18.1,41.77 18.1,55.42 18.73,56.05 18.73,57.01 17.78,57.96 17.78,59.87 19.05,60.82 19.05,63.04 18.41,63.68 18.41,70.98 17.78,71.61 15.56,71.61 D6.A
N$26
  Top 0.406: LM4562_.2 53.66,57.33 C6.2 51.12,56.69 | 51.12,56.69 R24.2 | R21.1 49.85,50.34 51.12,50.97 51.12,56.69
N$27
  Top 0.406: C28.2 R29.2 4.13,35.1 6.35,37.32 OPA2.2
  Bottom 0.406: OPA2.2 8.25,39.55 8.25,45.26 R28.1
N$28
  Top 0.406: C28.1 R29.1 4.13,38.27 OPA2.1
  Bottom 0.406: D4.A 1.59,75.42 2.22,74.79 2.22,57.01 2.92,55.74 2.92,44.94 3.49,43.99 R30.2 6.35,43.36 OPA2.1
N$30  (via drill 0.6)
  Top 0.406: R27.2 46.99,54.47 47.94,56.37 47.94,60.18 R24.1 C6.1 53.02,59.87 LM4562_.1 | LM4562_.5 64.45,53.2 62.55,55.1 v61.28,55.1
  Bottom 0.406: v61.28,55.1 58.74,55.1 58.1,55.74 58.1,59.55 57.79,59.87 LM4562_.1
N$31
  Top 0.406: LM4562_.7 LM4562_.6 65.4,54.15 68.58,54.15 R32.2
N$32  (via drill 0.6)
  Top 0.406: R44.2 R32.1 69.22,46.53 65.4,46.85 v61.28,46.85 | v54.61,48.37 47.94,48.37 R27.1
  Bottom 0.406: v61.28,46.85 55.88,46.85 v54.61,48.37
N$33  (via drill 0.6)
  Top 0.406: R34.2 C15.2 53.02,71.93 LM4562.2 | v61.28,53.51 62.86,53.51 63.5,50.97 v65.09,50.66
  Bottom 0.406: LM4562.2 55.56,69.07 54.29,67.8 54.29,54.47 54.93,53.51 v61.28,53.51 | v65.09,50.66 65.72,51.29 68.9,51.29 68.9,53.83 R33.1
N$34  (via drill 0.6)
  Top 0.406: LM4562.1 55.25,71.93 52.39,74.79 C15.1 R34.1 | R35.2 74.61,53.51 74.61,52.56 73.34,51.29 72.39,51.29 71.44,52.25 71.44,53.51 70.8,54.15 69.85,54.15 68.58,55.42 68.58,60.82 67.31,62.09 63.82,62.09 63.18,62.72 LM4562.5 60.96,64.31 60.96,65.26 60.01,66.22 60.01,70.66 v61.28,70.66
  Bottom 0.406: v61.28,70.66 56.83,70.66 LM4562.1
N$35
  Top 0.406: LM4562.7 LM4562.6
  Bottom 0.406: R36.2 49.85,68.44 50.16,68.12 53.34,68.12 53.97,68.75 53.97,69.71 54.93,70.66 55.88,70.66 58.42,68.12 58.74,68.12 60.01,69.39 LM4562.7
N$36
  Bottom 0.406: TL072.7 63.5,87.49 62.23,88.76 59.69,88.76 59.05,88.12 R37.2
N$37  (via drill 0.6)
  Top 0.406: R36.1 49.21,64.31 R43.2 | v61.28,50.97 62.55,49.7 65.4,49.7 66.36,49.07 67.94,49.07 68.9,49.7 70.8,49.7 v71.44,50.34
  Bottom 0.406: R36.1 51.12,62.72 51.12,52.25 52.39,50.97 v61.28,50.97 | v71.44,50.34 71.44,54.47 71.75,54.79 71.75,59.23 R35.1
N$42
  Top 0.406: D4.C R3.1 D2.C 3.18,85.58 3.18,83.04 3.49,82.73 5.08,82.73 6.35,84 TL001.3
N$43
  Top 0.406: IN_L_2.SW 29.72,54.02 29.84,54.15 29.84,52.25 | 29.84,52.25 29.84,40.18 39.05,40.18 IN_R_1.SW | IN_L_1.T 39.05,57.01 36.83,54.79 36.83,52.25 29.84,52.25
  Bottom 0.406: IN_L_1.T 39.05,68.44 25.72,81.77 25.72,93.52 28.89,95.11 31.11,95.11 CH_1_POT.3
N$44
  Top 0.813: JP6.1 JP6.2 49.85,104.95 50.8,105.9 F4.P$2
N$45
  Top 0.813: JP6.10 JP6.9 F5.P$2
N$46
  Bottom 0.406: TL001.1 9.84,89.08 R38.2
N$47
  Top 0.406: TL072.5 68.9,82.41 D7.C D8.C R4.1
N$48
  Top 0.406: TL001.7 16.19,84.63 17.78,84.63 17.78,87.49 18.41,88.12 R2.2
N$52
  Top 0.406: D10.C D9.C R39.1
  Bottom 0.406: TL072.3 60.64,84.95 59.37,83.68 59.37,80.82 R39.1

### Text on the board
tPlace: power | ptc | ciao v1.1 _ T | +12 | GND | -12 | ptc | ciao v1.1 _ A | ciao v1.1 _ B | ciao v1.1 _ C
bPlace: ciao v1.1 _ T | ciao v1.1 _ B | ciao v1.1 _ A | ciao v1.1 _ C